# Altium project board_2_PCB_lab.PrjPcb
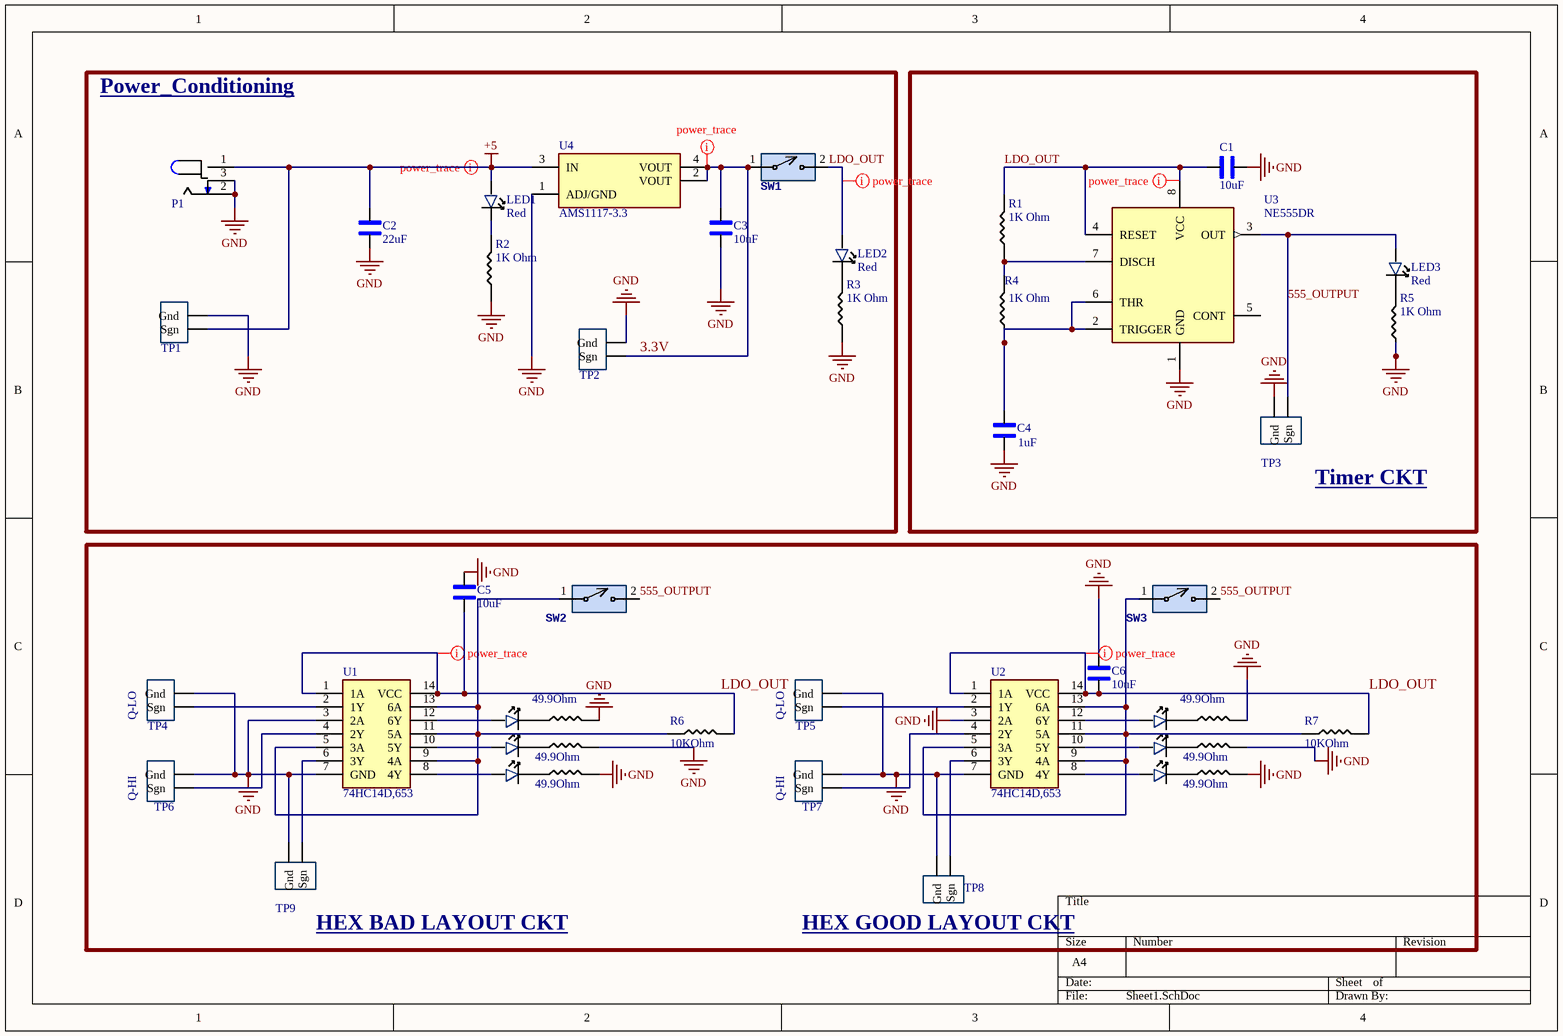
[diagram p0: Sheet1.SchDoc]
1 sheet, 45 parts. Net scope: global (net labels, ports and power ports of the same name join across sheets).
Board files: PCB2.PcbDoc, ECEN5730_BOARD2.PcbDoc

## Sheet Sheet1.SchDoc
size A4; SheetNumber: 1; SheetTotal: 1

### Parts
C1  10uF  [0402_Passive_Capacitor]
C2  22uF  [0805_Passive_Capaciitor]
C3  10uF  [0402_Passive_Capacitor]
C4  1uF  [1206_Passive_Capacitor]
C5  10uF  [0402_Passive_Capacitor]
C6  10uF  [0402_Passive_Capacitor]
LED1  value Red  [LED_0603]  (hidden comment: KT-0603R)
LED2  value Red  [LED_0603]  (hidden comment: KT-0603R)
LED3  value Red  [LED_0603]  (hidden comment: KT-0603R)
LED4  KT-0603R  [LED_0603]  (value not drawn)
LED5  KT-0603R  [LED_0603]  (value not drawn)
LED6  KT-0603R  [LED_0603]  (value not drawn)
LED7  KT-0603R  [LED_0603]  (value not drawn)
LED8  KT-0603R  [LED_0603]  (value not drawn)
LED9  KT-0603R  [LED_0603]  (value not drawn)
P1  Power Jack  [Power_Jack]  (value not drawn)
R1  value 1K Ohm  [1206_Passive_Resitor]  (hidden comment: 1k)
R2  value 1K Ohm  [1206_Passive_Resitor]  (hidden comment: 1k)
R3  value 1K Ohm  [1206_Passive_Resitor]  (hidden comment: 1k)
R4  value 1K Ohm  [1206_Passive_Resitor]  (hidden comment: 1k)
R5  value 1K Ohm  [1206_Passive_Resitor]  (hidden comment: 1k)
R6  value 10KOhm  [0402_Passive_Resistor]  (hidden comment: 10k)
R7  value 10KOhm  [0402_Passive_Resistor]  (hidden comment: 10k)
R8  value 49.9Ohm  [0402_Passive_Resistor]  (hidden comment: 50 Ohms)
R9  value 49.9Ohm  [0402_Passive_Resistor]  (hidden comment: 50 Ohms)
R10  value 49.9Ohm  [0402_Passive_Resistor]  (hidden comment: 50 Ohms)
R11  value 49.9Ohm  [0402_Passive_Resistor]  (hidden comment: 50 Ohms)
R12  value 49.9Ohm  [0402_Passive_Resistor]  (hidden comment: 50 Ohms)
R13  value 49.9Ohm  [0402_Passive_Resistor]  (hidden comment: 50 Ohms)
SW1  on_off_switch  [2Pin-Header-Conn]  (value not drawn)
SW2  on_off_switch  [2Pin-Header-Conn]  (value not drawn)
SW3  on_off_switch  [2Pin-Header-Conn]  (value not drawn)
TP1  TP_5V  [TP10x_Probe]  (value not drawn)
TP2  TP_5V  [TP10x_Probe]  (value not drawn)
TP3  TP_555_OUTPUT  [TP10x_Probe]  (value not drawn)
TP4  TP_555_OUTPUT  [TP10x_Probe]  (value not drawn)
TP5  TP_555_OUTPUT  [TP10x_Probe]  (value not drawn)
TP6  TP_555_OUTPUT  [TP10x_Probe]  (value not drawn)
TP7  TP_555_OUTPUT  [TP10x_Probe]  (value not drawn)
TP8  TP_555_OUTPUT  [TP10x_Probe]  (value not drawn)
TP9  TP_555_OUTPUT  [TP10x_Probe]  (value not drawn)
U1  74HC14D,653  [HEX_74AC14]
U2  74HC14D,653  [HEX_74AC14]
U3  NE555DR  [TS555IDTTR]
U4  AMS1117-3.3  [LDO]

### Blocks framed on the sheet
Power_Conditioning: C2 C3 LED1 LED2 P1 R2 R3 SW1 TP1 TP2 U4
Timer CKT: C1 C4 LED3 R1 R4 R5 TP3 U3

### Nets
+5: C2.2 LED1.1 P1.1 TP1.1(Sgn) U4.3(IN)
GND: C1.1 C2.1 C3.1 C4.1 C5.1 C6.1 P1.2 P1.3 R2.1 R3.1 R5.1 R8.2 R9.2 R10.2 R11.2 R12.2 R13.2 TP1.2(Gnd) TP2.2(Gnd) TP3.2(Gnd) TP4.2(Gnd) TP5.2(Gnd) TP6.2(Gnd) TP7.2(Gnd) TP8.2(Gnd) TP9.2(Gnd) U1.3(2A) U1.7(GND) U2.3(2A) U2.7(GND) U3.1(GND) U4.1(ADJ/GND)
3.3V: C3.2 SW1.1 TP2.1(Sgn) U4.2(VOUT) U4.4(VOUT)
555_OUTPUT: LED3.1 SW2.2 SW3.2 TP3.1(Sgn) U3.3(OUT)
LDO_OUT: C1.2 C5.2 C6.2 LED2.1 R1.2 R6.2 R7.2 SW1.2 U1.1(1A) U1.14(VCC) U2.1(1A) U2.14(VCC) U3.4(RESET) U3.8(VCC)
NetC4_2: C4.2 R4.1 U3.2(TRIGGER) U3.6(THR)
NetLED1_2: LED1.2 R2.2
NetLED2_2: LED2.2 R3.2
NetLED3_2: LED3.2 R5.2
NetLED4_1: LED4.1 U1.12(6Y)
NetLED4_2: LED4.2 R8.1
NetLED5_1: LED5.1 U2.12(6Y)
NetLED5_2: LED5.2 R9.1
NetLED6_1: LED6.1 U1.10(5Y)
NetLED6_2: LED6.2 R12.1
NetLED7_1: LED7.1 U2.10(5Y)
NetLED7_2: LED7.2 R11.1
NetLED8_1: LED8.1 U1.8(4Y)
NetLED8_2: LED8.2 R10.1
NetLED9_1: LED9.1 U2.8(4Y)
NetLED9_2: LED9.2 R13.1
NetR1_1: R1.1 R4.2 U3.7(DISCH)
NetR6_1: R6.1 SW2.1 U1.5(3A) U1.9(4A) U1.11(5A) U1.13(6A)
NetR7_1: R7.1 SW3.1 U2.5(3A) U2.9(4A) U2.11(5A) U2.13(6A)
NetTP4_1: TP4.1(Sgn) U1.2(1Y)
NetTP5_1: TP5.1(Sgn) U2.2(1Y)
NetTP6_1: TP6.1(Sgn) U1.4(2Y)
NetTP7_1: TP7.1(Sgn) U2.4(2Y)
NetTP8_1: TP8.1(Sgn) U2.6(3Y)
NetTP9_1: TP9.1(Sgn) U1.6(3Y)

Not connected (* = marked no-connect by the designer): U3 5(CONT)

### Layout directives
rule Width Constraint [Pref Width = 20mil    Min Width = 10mil    Max Width = 100mil]; rule Width Constraint [Pref Width = 20mil    Min Width = 10mil    Max Width = 100mil]; rule Width Constraint [Pref Width = 20mil    Min Width = 10mil    Max Width = 100mil]: 3.3V, +5, LDO_OUT

### Notes on the sheet
- (near TP4) Q-LO
- (near TP5) Q-LO
- (near TP6) Q-HI
- (near TP7) Q-HI
- (near TP9) HEX BAD LAYOUT CKT
- (near TP8) HEX GOOD LAYOUT CKT

### Library data of the parts
C1 C3 C5 C6 = C_10uF_0402: 10uF ±20% 6.3V X5R 0402 Multilayer Ceramic Capacitors MLCC - SMD/SMT RoHS; MFR Part #: CL05A106MQ5NUNC; Type: Basic; LCSC Part#: C15525; Datasheet: https://datasheet.lcsc.com/lcsc/1810191215_Samsung-Electro-Mechanics-CL05A106MQ5NUNC_C15525.pdf; Value: 10uF
C2 = C_22uF_0805: MULTILAYER CERAMIC CAPACITORS MLCC - SMD/SMT 22UF 25V 0805 ROHS; MFR Part #: CL21A226MAQNNNE; Type: Basic; Datasheet: https://datasheet.lcsc.com/szlcsc/Samsung-Electro-Mechanics-CL21A226MAQNNNE_C45783.pdf; LCSC Part#: C45783; Value: 22uF
C4 = C_1uF_1206: MULTILAYER CERAMIC CAPACITORS MLCC - SMD/SMT 1UF 50V 1206 ROHS; MFR Part #: CL31B105KBHNNNE; Type: Basic; Digikey Link: https://www.digikey.com/product-detail/en/C1206C105M4RACTU/399-8150-1-ND/3471873/?itemSeq=304982366; Digikey Part: 399-8150-1-ND; LCSC Part#: C1848; Value: 1uF
LED1-LED9 = LED_RED_0603: LIGHT EMITTING DIODES (LED) RED 520~625NM 90~100MCD@20MA TOP VIEW 0603 ROHS; Type: Basic; Datasheet: https://datasheet.lcsc.com/szlcsc/Everlight-Elec-19-217-BHC-ZL1M2RY-3T_C72041.pdf; MFR Part #: KT-0603R; LCSC Part#: C2286
  LED4-LED9: Value: Red
P1 = P_Power Jack: Power Barrel Connector Jack 2.10mm ID (0.083"), 5.50mm OD (0.217") Through Hole, Right Angle; Value: CONN PWR JACK 2X5.5MM SOLDER; Digikey Link: https://www.digikey.com/product-detail/en/PJ-102A/CP-102A-ND/275425/?itemSeq=304982367; Digikey Part: CP-102A-ND; LCSC Part#: C136744; Type: Extended
R1-R5 = R_1K_1206: CHIP RESISTOR - SURFACE MOUNT 1KOHMS ±1% 1/4W 1206 ROHS; MFR Part #: 1206W4F1001T5; Digikey Link: https://www.digikey.com/product-detail/en/RNCP1206FTD1K00/RNCP1206FTD1K00CT-ND/2240675/?itemSeq=304982373; Digikey Part: RNCP1206FTD1K00CT-ND; LCSC Part#: C4410; Type: Basic
R6 R7 = R_10KOhm_0402: CHIP RESISTOR - SURFACE MOUNT 10KOHMS ±1% 1/16W 0402 ROHS; MFR Part #: 0402WGF1002TCE; Datasheet: https://datasheet.lcsc.com/szlcsc/Uniroyal-Elec-0402WGF1002TCE_C25744.pdf; LCSC Part#: C25744; Type: Basic
R8-R13 = R_50Ohm_0402: CHIP RESISTOR - SURFACE MOUNT 49.9OHMS ±1% 1/16W 0402 ROHS; MFR Part #: 0402WGF499JTCE; Datasheet: https://datasheet.lcsc.com/szlcsc/Uniroyal-Elec-0402WGF499JTCE_C25120.pdf; LCSC Part#: C25120; Type: Basic
SW1-SW3 = SW_2Pin_100mil_Switch: 2Pin Header; LCSC Part#: C124375; Type: Extended
TP1-TP9 = TP_10x_Probe: Test Point 300 mil centers
U1 U2 = U_7414_HC_Hex: Inverter IC 6 Channel Schmitt Trigger 14-SOIC; Datasheet: https://datasheet.lcsc.com/szlcsc/ON-Semicon-ON-74AC14SCX_C5482.pdf; MFR Part #: 74HC14D,653; LCSC Part#: C5605; Type: Basic
U3 = U_555_Slow: 555 Timer SOIC-8_150MIL ROHS 150ns Rise Time; MFR Part #: NE555DR; Digikey Link: https://www.digikey.com/product-detail/en/texas-instruments/NE555DR/296-6501-1-ND/372490; Type: Basic; LCSC Part#: C7593
U4 = PS_AMS_LDO_3v3: LOW DROPOUT REGULATORS(LDO) POSITIVE FIXED 1.3V @ 800MA 15V 3.3V 1A SOT-223 ROHS; Value: IC REG LINEAR 3.3V 800MA SOT223; MFR Part #: AMS1117-3.3; LCSC Part#: C6186; Type: Basic